# Altium schematic sheet CROSS.SchDoc
size 594 x 420 mm; Address1: Address1; Address2: Address2; Address3: Address3; Address4: Address4; DocumentNumber: АБВГ.123456.001 Э3; SheetNumber: 1; Scale: 1:1; DocumentType: Схема электрическая принципиальная; FirstReferrence: АБВГ.123456.001
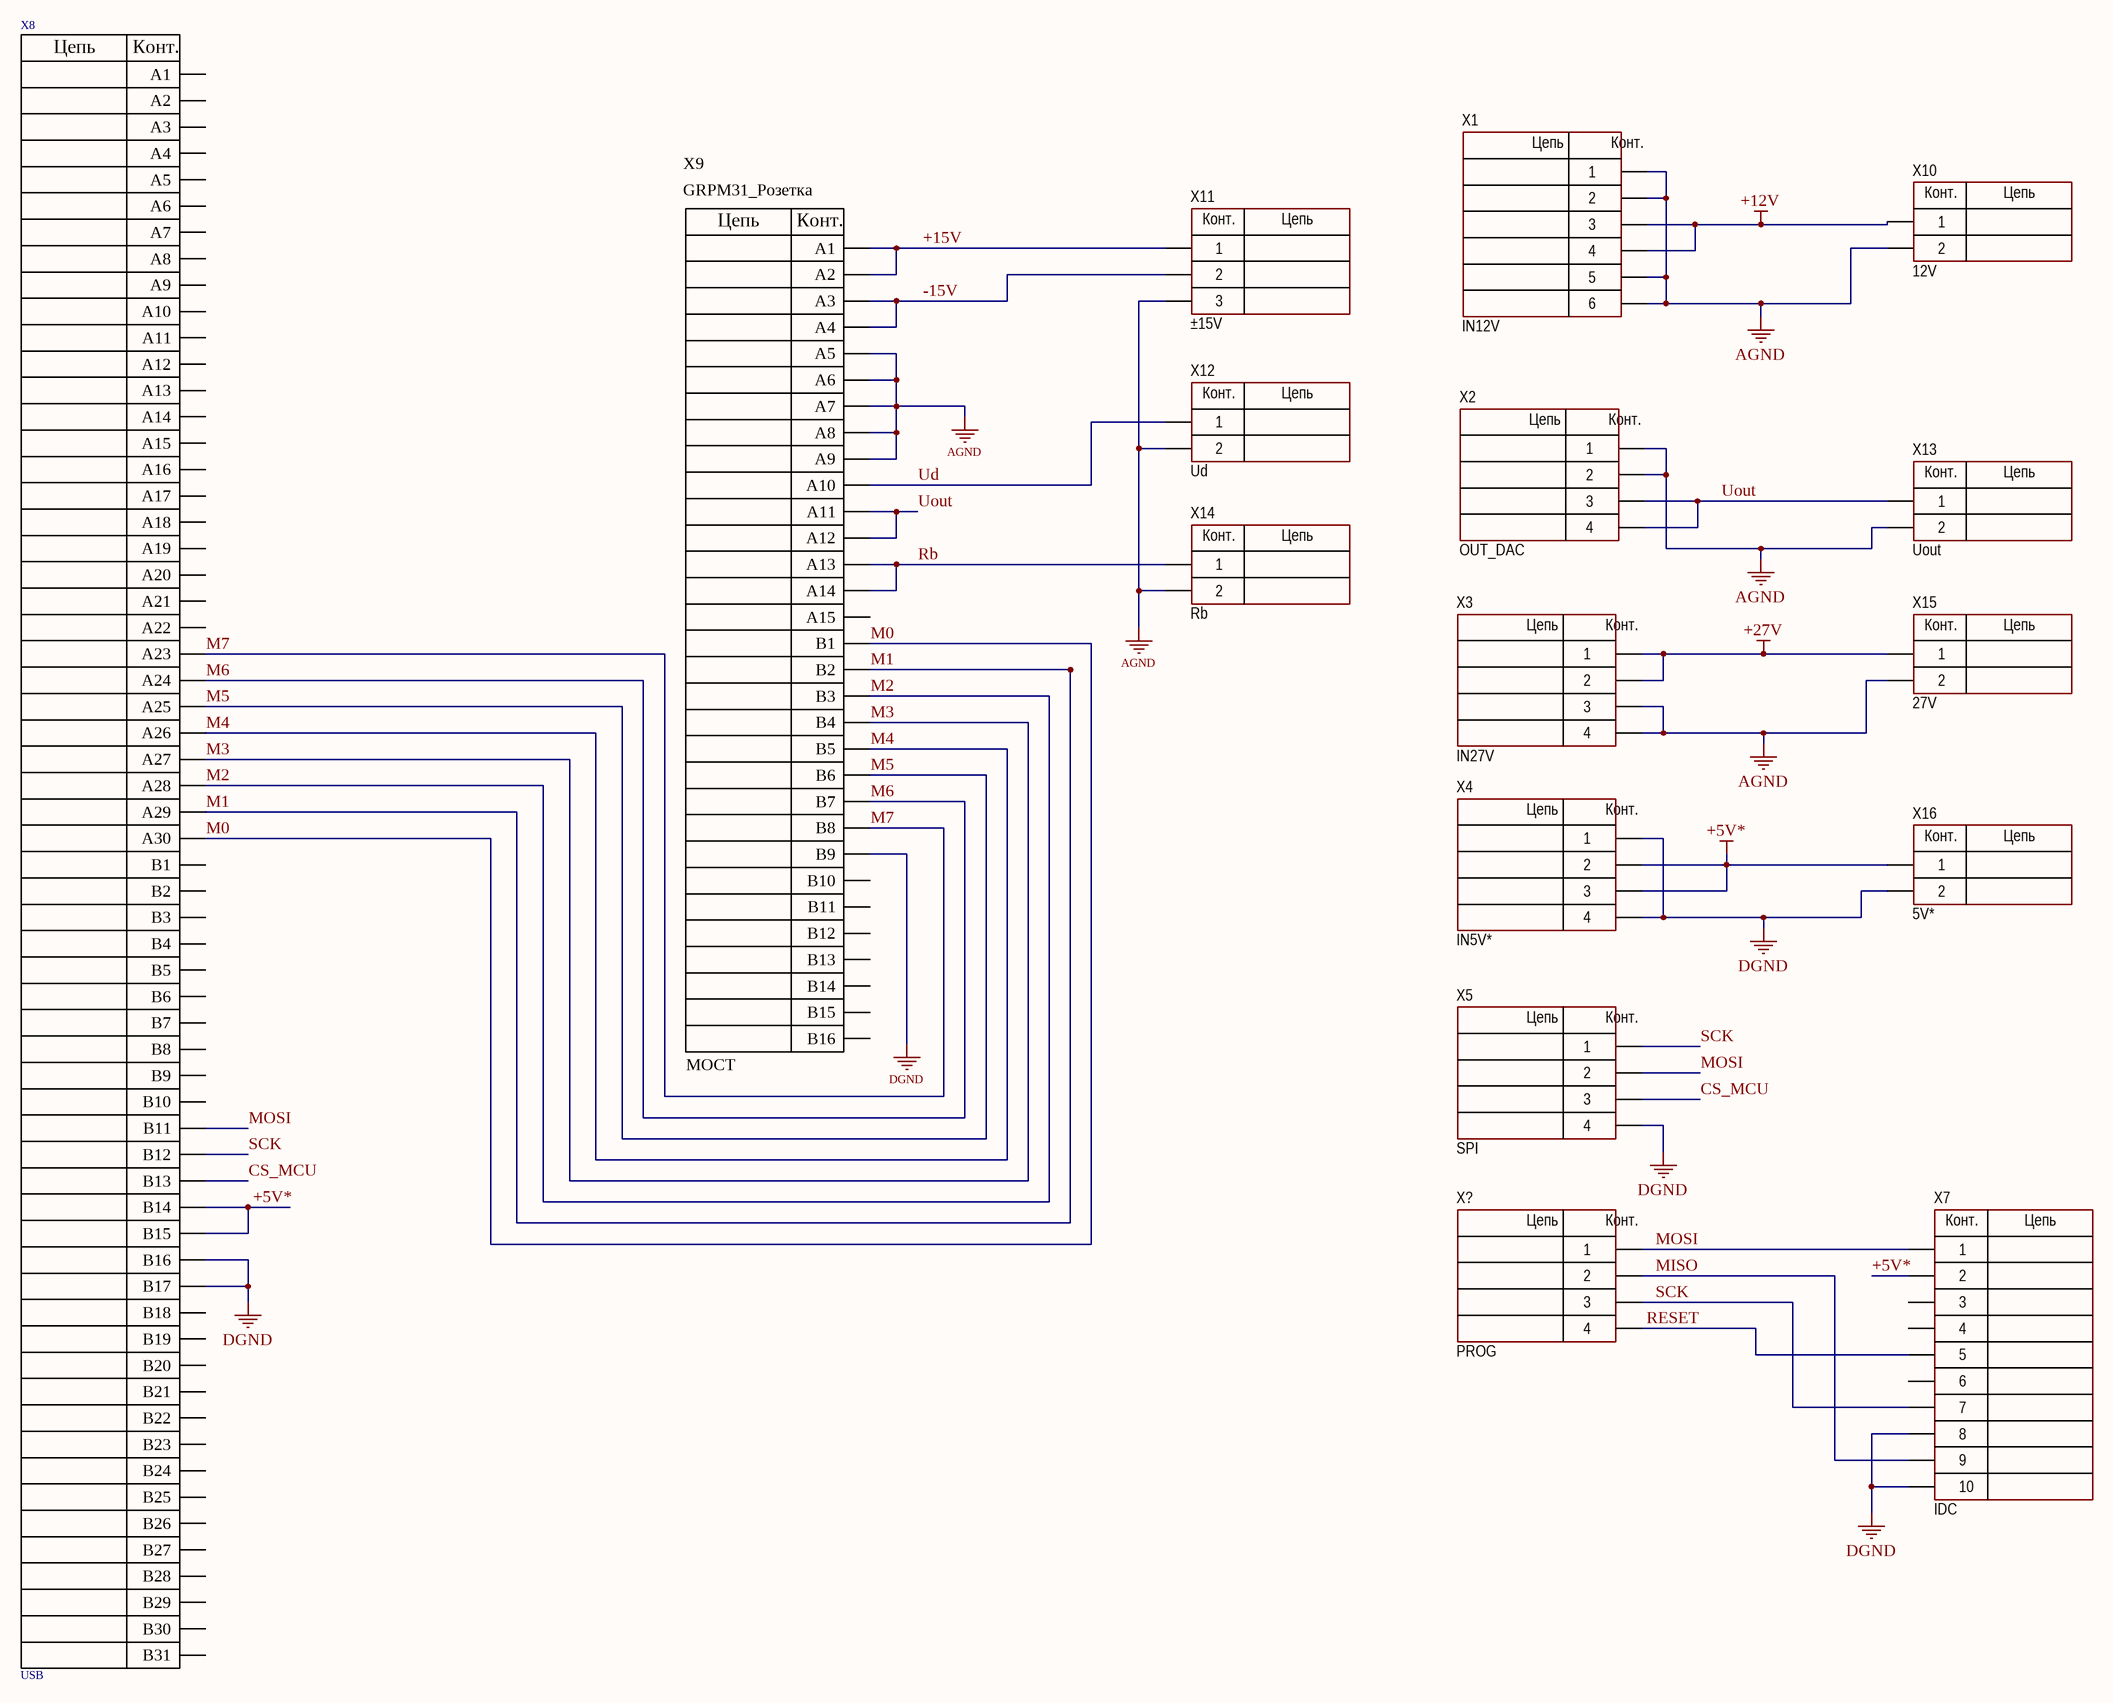
[diagram p0: CROSS.SchDoc]

## Parts
X1  CommentText: IN12V  [CON: PLS-6]
X2  CommentText: OUT_DAC  [CON: PLS-4]
X3  CommentText: IN27V  [CON: PLS-4]
X4  CommentText: IN5V*  [CON: PLS-4]
X5  CommentText: SPI  [CON: PLS-4]
X7  CommentText: IDC  [CON: IDC-10MS]
X8  USB  [GRPM61_socket]
X9  GRPM31_Розетка  [GRPM31_fork]
X10  CommentText: 12V  [CON: PLS-2]
X11  CommentText: ±15V  [CON: PLS-3]
X12  CommentText: Ud  [CON: PLS-2]
X13  CommentText: Uout  [CON: PLS-2]
X14  CommentText: Rb  [CON: PLS-2]
X15  CommentText: 27V  [CON: PLS-2]
X16  CommentText: 5V*  [CON: PLS-2]
X?  CommentText: PROG  [CON: PLS-4]

## Nets
+5V*: X4.2 X4.3 X7.2 X8.B14 X8.B15 X16.1
+12V: X1.3 X1.4 X10.1
+27V: X3.1 X3.2 X15.1
AGND: X1.1 X1.2 X1.5 X1.6 X2.1 X2.2 X3.3 X3.4 X9.A5 X9.A6 X9.A7 X9.A8 X9.A9 X10.2 X11.3 X12.2 X13.2 X14.2 X15.2
DGND: X4.1 X4.4 X5.4 X7.8 X7.10 X8.B16 X8.B17 X9.B9 X16.2
+15V: X9.A1 X9.A2 X11.1
-15V: X9.A3 X9.A4 X11.2
CS_MCU: X5.3 X8.B13
M0: X8.A30 X9.B1
M1: X8.A29 X9.B2
M2: X8.A28 X9.B3
M3: X8.A27 X9.B4
M4: X8.A26 X9.B5
M5: X8.A25 X9.B6
M6: X8.A24 X9.B7
M7: X8.A23 X9.B8
MISO: X7.9 X?.2
MOSI: X5.2 X7.1 X8.B11 X?.1
Rb: X9.A13 X9.A14 X14.1
RESET: X7.5 X?.4
SCK: X5.1 X7.7 X8.B12 X?.3
Ud: X9.A10 X12.1
Uout: X2.3 X2.4 X9.A11 X9.A12 X13.1

Not connected (* = marked no-connect by the designer): X7 3 4 6; X8 A1 A2 A3 A4 A5 A6 A7 A8 A9 A10 A11 A12 A13 A14 A15 A16 A17 A18 A19 A20 A21 A22 B1 B2 B3 B4 B5 B6 B7 B8 B9 B10 B18 B19 B20 B21 B22 B23 B24 B25 B26 B27 B28 B29 B30 B31; X9 A15 B10 B11 B12 B13 B14 B15 B16

## Notes on the sheet
- Перв. примен.
- Справ. №
- Подп. и дата
- Инв. № дубл.
- Взам. инв. №
- Разраб.
- Изм.
- Лист
- № докум.
- Подп.
- Дата
- Лит.
- Масса
- Масштаб
- Пров.
- Т.контр.
- Листов
- Инв. № подл.
- Утв.
- Н.контр.
- 2.106-A2
- Копировал
- Формат А2
- (in symbol Component_1) Цепь; Конт.
- (in symbol GRPM) Цепь; Конт.; МОСТ
- (in symbol IDC-10) Конт.; Цепь
- (in symbol PLS-2) Конт.; Цепь
- (in symbol PLS-3) Конт.; Цепь
- (in symbol PLS-4) Цепь; Конт.
- (in symbol PLS-6) Цепь; Конт.

## Library data of the parts
X1 = PLS-6: Manufacturer: Connfly; ValueManufacturerPartNumber: Connector, 6pin, 2.54mm, 500VAC, 3A; TypeConnector: Connector; VoltageMax: 500VAC; Pitch: 2.54mm; CurrentMax: 3A; Multichannel: 6pin; HelpURL: https://www.chipdip.ru/product/pls-6; PartNumber: PLS-6
X2-X5 X? = PLS-4: Manufacturer: Connfly; ValueManufacturerPartNumber: Connector, 4pin, 2.54mm, 500VAC, 3A; TypeConnector: Connector; VoltageMax: 500VAC; Pitch: 2.54mm; CurrentMax: 3A; Multichannel: 4pin; HelpURL: https://www.chipdip.ru/product/pls-4; PartNumber: PLS-4
X7 = IDC-10: Manufacturer: Connfly; ValueManufacturerPartNumber: Connector, 10pin, 2.54mm, 250VAC, 3A; TypeConnector: Connector; VoltageMax: 250VAC; Pitch: 2.54mm; CurrentMax: 3A; Multichannel: 10pin; HelpURL: https://www.chipdip.ru/product/idc-10ms; PartNumber: IDC-10
X8 = Component_1
X9 = GRPM
X10 X12-X16 = PLS-2: Manufacturer: Connfly; ValueManufacturerPartNumber: Connector, 2pin, 2.54mm, 500VAC, 3A; TypeConnector: Connector; VoltageMax: 500VAC; Pitch: 2.54mm; CurrentMax: 3A; Multichannel: 2pin; HelpURL: https://www.chipdip.ru/product/pls-2; PartNumber: PLS-2
X11 = PLS-3: Manufacturer: Connfly; ValueManufacturerPartNumber: Connector, 3pin, 2.54mm, 500VAC, 3A; TypeConnector: Connector; VoltageMax: 500VAC; Pitch: 2.54mm; CurrentMax: 3A; Multichannel: 3pin; HelpURL: https://www.chipdip.ru/product/pls-3; PartNumber: PLS-3